# Altium schematic sheet TPS61022.SchDoc
size A4
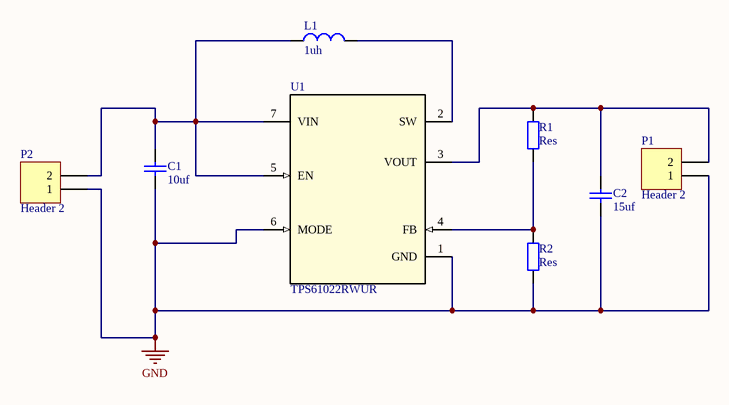
[diagram p0: TPS61022.SchDoc]

## Parts
C1  10uf  [0805]
C2  15uf  [0805]
L1  1uh  [L]
P1  Header 2  [HDR1X2]
P2  Header 2  [HDR1X2]
R1  Res  [0805]
R2  Res  [0805]
U1  TPS61022RWUR  [RWU0007A]

## Nets
GND: C1.1 C2.1 P1.1 P2.1 R2.1 U1.1(GND) U1.6(MODE)
NetC1_2: C1.2 L1.1 P2.2 U1.5(EN) U1.7(VIN)
NetC2_2: C2.2 P1.2 R1.2 U1.3(VOUT)
NetL1_2: L1.2 U1.2(SW)
NetR1_1: R1.1 R2.2 U1.4(FB)

## Library data of the parts
C1 C2 = C: 电容
L1 = L: 大号贴片电感
P1 P2 = Header 2: Header, 2-Pin; LatestRevisionDate: 17-Jul-2002; LatestRevisionNote: Re-released for DXP Platform.; Publisher: Altium Limited
R1 R2 = R: 电阻
U1 = TPS61022RWUR: Imported; Manufacturer: Texas Instruments; PartNumber: TPS61022RWUR; RefDes: RefDes; TYPE: TYPE; Value: Value